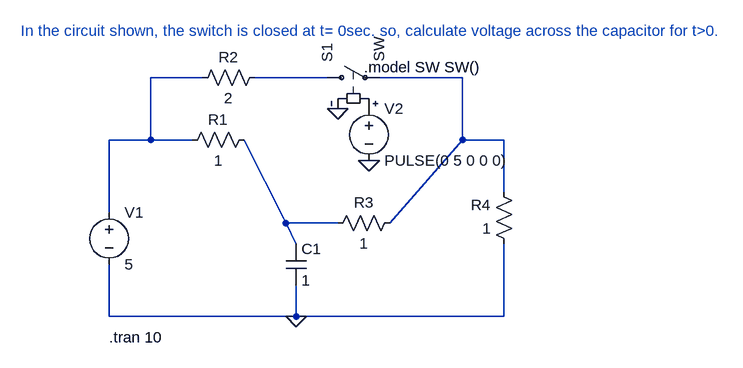
[diagram p0: schematic Lab4_ques4.asc]
Lab4_ques4.asc, the LTspice schematic file:
Version 4
SHEET 1 968 680
WIRE 144 112 64 112
WIRE 336 112 224 112
WIRE 544 112 416 112
WIRE 64 208 64 112
WIRE 64 208 0 208
WIRE 128 208 64 208
WIRE 544 208 544 112
WIRE 608 208 544 208
WIRE 608 288 608 208
WIRE 0 320 0 208
WIRE 272 336 208 208
WIRE 352 336 272 336
WIRE 432 336 544 208
WIRE 288 368 272 336
WIRE 0 480 0 400
WIRE 288 480 288 432
WIRE 288 480 0 480
WIRE 608 480 608 368
WIRE 608 480 288 480
FLAG 352 160 0
FLAG 400 240 0
FLAG 288 480 0
SYMBOL Voltage 0 304 R0
SYMATTR InstName V1
SYMATTR Value 5
SYMBOL Res 224 192 R90
WINDOW 0 0 56 VBottom 2
WINDOW 3 32 56 VTop 2
SYMATTR InstName R1
SYMATTR Value 1
SYMBOL Res 240 96 R90
WINDOW 0 0 56 VBottom 2
WINDOW 3 32 56 VTop 2
SYMATTR InstName R2
SYMATTR Value 2
SYMBOL Res 448 320 R90
WINDOW 0 0 56 VBottom 2
WINDOW 3 32 56 VTop 2
SYMATTR InstName R3
SYMATTR Value 1
SYMBOL Res 624 384 R180
WINDOW 0 36 76 Left 2
WINDOW 3 36 40 Left 2
SYMATTR InstName R4
SYMATTR Value 1
SYMBOL sw 320 112 R270
SYMATTR InstName S1
SYMBOL Voltage 400 144 R0
SYMATTR InstName V2
SYMATTR Value PULSE(0 5 0 0 0)
SYMBOL Cap 272 368 R0
SYMATTR InstName C1
SYMATTR Value 1
TEXT -136 40 Left 2 ;In the circuit shown, the switch is closed at t= 0sec. so, calculate voltage across the capacitor for t>0.
TEXT 0 512 Left 2 !.tran 10
TEXT 392 96 Left 2 !.model SW SW()

The netlist it stands for:
* Lab4_ques4.asc
V1 N001 0 5
R1 N004 N001 1
R2 N002 N001 2
R3 N003 N004 1
R4 0 N003 1
S1 N002 N003 P001 0 SW
V2 P001 0 PULSE(0 5 0 0 0)
C1 N004 0 1
* In the circuit shown, the switch is closed at t= 0sec. so, calculate voltage across the capacitor for t>0.
.tran 10
.model SW SW()
.backanno
.end